# Altium schematic sheet Sheet1.SchDoc
size A4
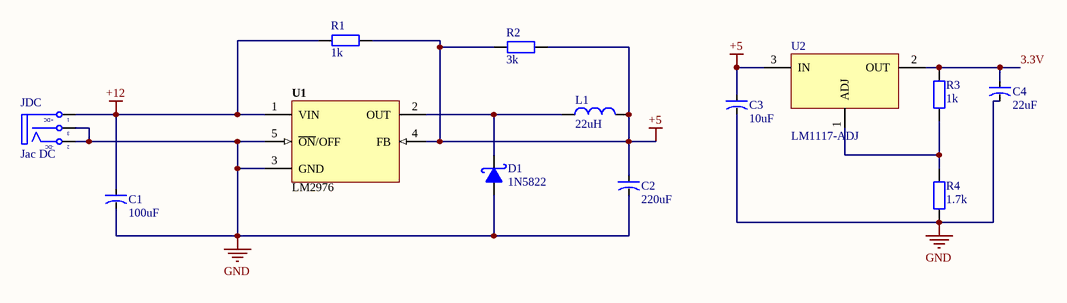
[diagram p0: Sheet1.SchDoc]

## Parts
C1  100uF  [CAP-ALU-SMD-4.5x5x1.4]
C2  220uF  [CAP-ALU-SMD-4.5x5x1.4]
C3  10uF  [CAP-ALU-SMD-4.5x5x1.4]
C4  22uF  [CA-ALU-2.54]
D1  1N5822  [DIO-SMD-123]
JDC  Jac DC  [DC-IN]
L1  22uH  [L-SMD-M-12x10]
R1  1k  [RES-SMD-0805]
R2  3k  [RES-SMD-0805]
R3  1k  [RES-SMD-0805]
R4  1.7k  [RES-SMD-0805]
U1  LM2976  [TO-263]
U2  LM1117-ADJ  [LM1117-SOP]

## Nets
+5: C2.1 C3.1 L1.2 R1.2 R2.1 R2.2 U1.4(FB) U2.3(IN)
+12: C1.1 JDC.1(T) R1.1 U1.1(VIN)
GND: C1.2 C2.2 C3.2 C4.2 D1.1(A) JDC.2(TN) JDC.3(S) R4.2 U1.3(GND) U1.5(~{ON}/OFF)
3.3V: C4.1 R3.2 U2.2(OUT)
NetD1_2: D1.2(K) L1.1 U1.2(OUT)
NetR3_1: R3.1 R4.1 U2.1(ADJ)

## Notes on the sheet
- (in symbol DCIN) +DC; -DC

## Library data of the parts
C1-C3 = CAP-ALU-SMD: Polarized Capacitor (Axial); Published: 8-Jun-2000; LatestRevisionDate: 17-Jul-2002; LatestRevisionNote: Re-released for DXP Platform.; PackageReference: POLAR0.8; Publisher: Altium Limited
C4 = CAP-ALU-DIP: Capacitor (Semiconductor SIM Model); Value: 104; LatestRevisionDate: 17-Jul-2002; LatestRevisionNote: Re-released for DXP Platform.; PackageReference: C1206; Publisher: Altium Limited
D1 = 1N5822: Schottky Rectifiers; Value: Diode c?m 1N5408
JDC = DCIN: Jac DC input; Value: Jac DC
L1 = Inductor: Value: 150 mH
R1-R4 = Resistor - SMD: Resistor SMD; Manufacturer: Generic Components; Class: Passive; Published: 08/06/2000; Publisher: Altium Hobart Technology Centre
U1 = LM2596: Max Input Voltage: 12 V; Max Output Current: 3 (6.0 peak) A; Max Output Voltage: mV; Category: IC-Power; Min Input Voltage: mV; Min Output Voltage: mV; Mounting Technology: Surface Mount; Status: Unreleased; Supply Voltage: mV; Temperature Range: -40 to +125 degC
U2 = LM1117-ADJ: 800mA Low-Dropout Linear Regulator; Creator: Nguyen Ba Bien; Website: http://group3i.net